# Altium schematic sheet Out1.SchDoc
size A; SheetNumber: 4; SheetTotal: 6
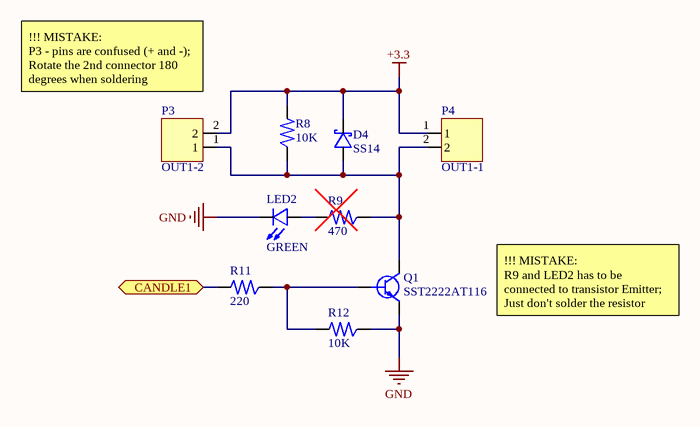
[diagram p0: Out1.SchDoc]

## Parts
D4  SS14  [SMT_DIODE_SCHTKY_VISHAI]
LED2  GREEN  [SMT_LED_0805(2012)_WURTH]
P3  OUT1-2  [THT_CON_WAFER_2P_NEL_2217S-02-WH2]
P4  OUT1-1  [THT_CON_WAFER_2P_NEL_2217S-02-WH2]
Q1  SST2222AT116  [SMT_TRANS_SST2222AT116_SOT23]
R8  10K  [SMT_RES_0805(2012)]
R9  470  [SMT_RES_0805(2012)]
R11  220  [SMT_RES_0805(2012)]
R12  10K  [SMT_RES_0805(2012)]

## Ports
CANDLE1 (bidir)

## Nets
+3.3: D4.2 P3.2 P4.1 R8.1
GND: LED2.1 Q1.1(E) R12.2
CANDLE1: R11.1 ; port CANDLE1
NetD4_1: D4.1 P3.1 P4.2 Q1.3(C) R8.2 R9.2
NetLED2_2: LED2.2 R9.1
NetQ1_2: Q1.2(B) R11.2 R12.1

## Notes on the sheet
- (near P3) !!! MISTAKE:
  P3 - pins are confused (+ and -);
  Rotate the 2nd connector 180 degrees when soldering
- !!! MISTAKE:
  R9 and LED2 has to be connected to transistor Emitter;
  Just don't solder the resistor

## Library data of the parts
D4 = SMT_DIODE_SCHTKY_VISHAI: SMT Diode Schottky Vishay DO-214AC SS14-M3/5AT IF=1A VR=40 V FV=0.5VG
LED2 = SMT_LED_0805(2012)_WURTH: LED 0805(2012) 20mA 2V 150080YS75000 by Wurth Elektronik
P3 P4 = THT_CON_WAFER_2P_NEL_2217S-02-WH2: Connector Wafer NELTRON 2-Pins Pitch-2.54mm 250V/3A 2217S-02-WH2
Q1 = SMT_TRANS_SST2222AT116_SOT23: Transistor NPN SST2222AT116 SOT23 700mA 40V
R8 R9 R11 R12 = SMT_RES_0805(2012): 0805(2012) Resistor 1/4-1/8W 150V 2A